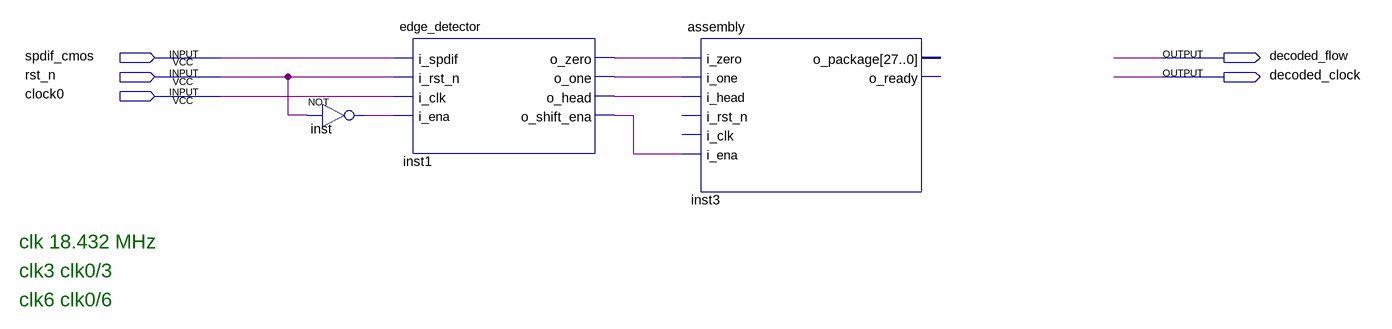
[diagram p0: schematic sheet]
// Quartus schematic main.bdf as structural Verilog: 3 symbols, 5 pins
module main (
  input  spdif_cmos,
  input  rst_n,
  input  clock0,
  output decoded_flow,
  output decoded_clock
);

  wire inst1_o_head, inst1_o_one, inst1_o_shift_ena, inst1_o_zero, inst_out;

  not inst (inst_out, rst_n);
  edge_detector inst1 (
    .i_spdif(spdif_cmos), .i_rst_n(rst_n), .i_clk(clock0), .i_ena(inst_out), .o_zero(inst1_o_zero),
    .o_one(inst1_o_one), .o_head(inst1_o_head), .o_shift_ena(inst1_o_shift_ena));
  assembly inst3 (
    .i_zero(inst1_o_zero), .i_one(inst1_o_one), .i_head(inst1_o_head), .i_ena(inst1_o_shift_ena));  // open: i_rst_n, i_clk, o_package, o_ready

  // Notes on the sheet:
  //   clk 18.432 MHz
  //   clk3 clk0/3
  //   clk6 clk0/6
endmodule
